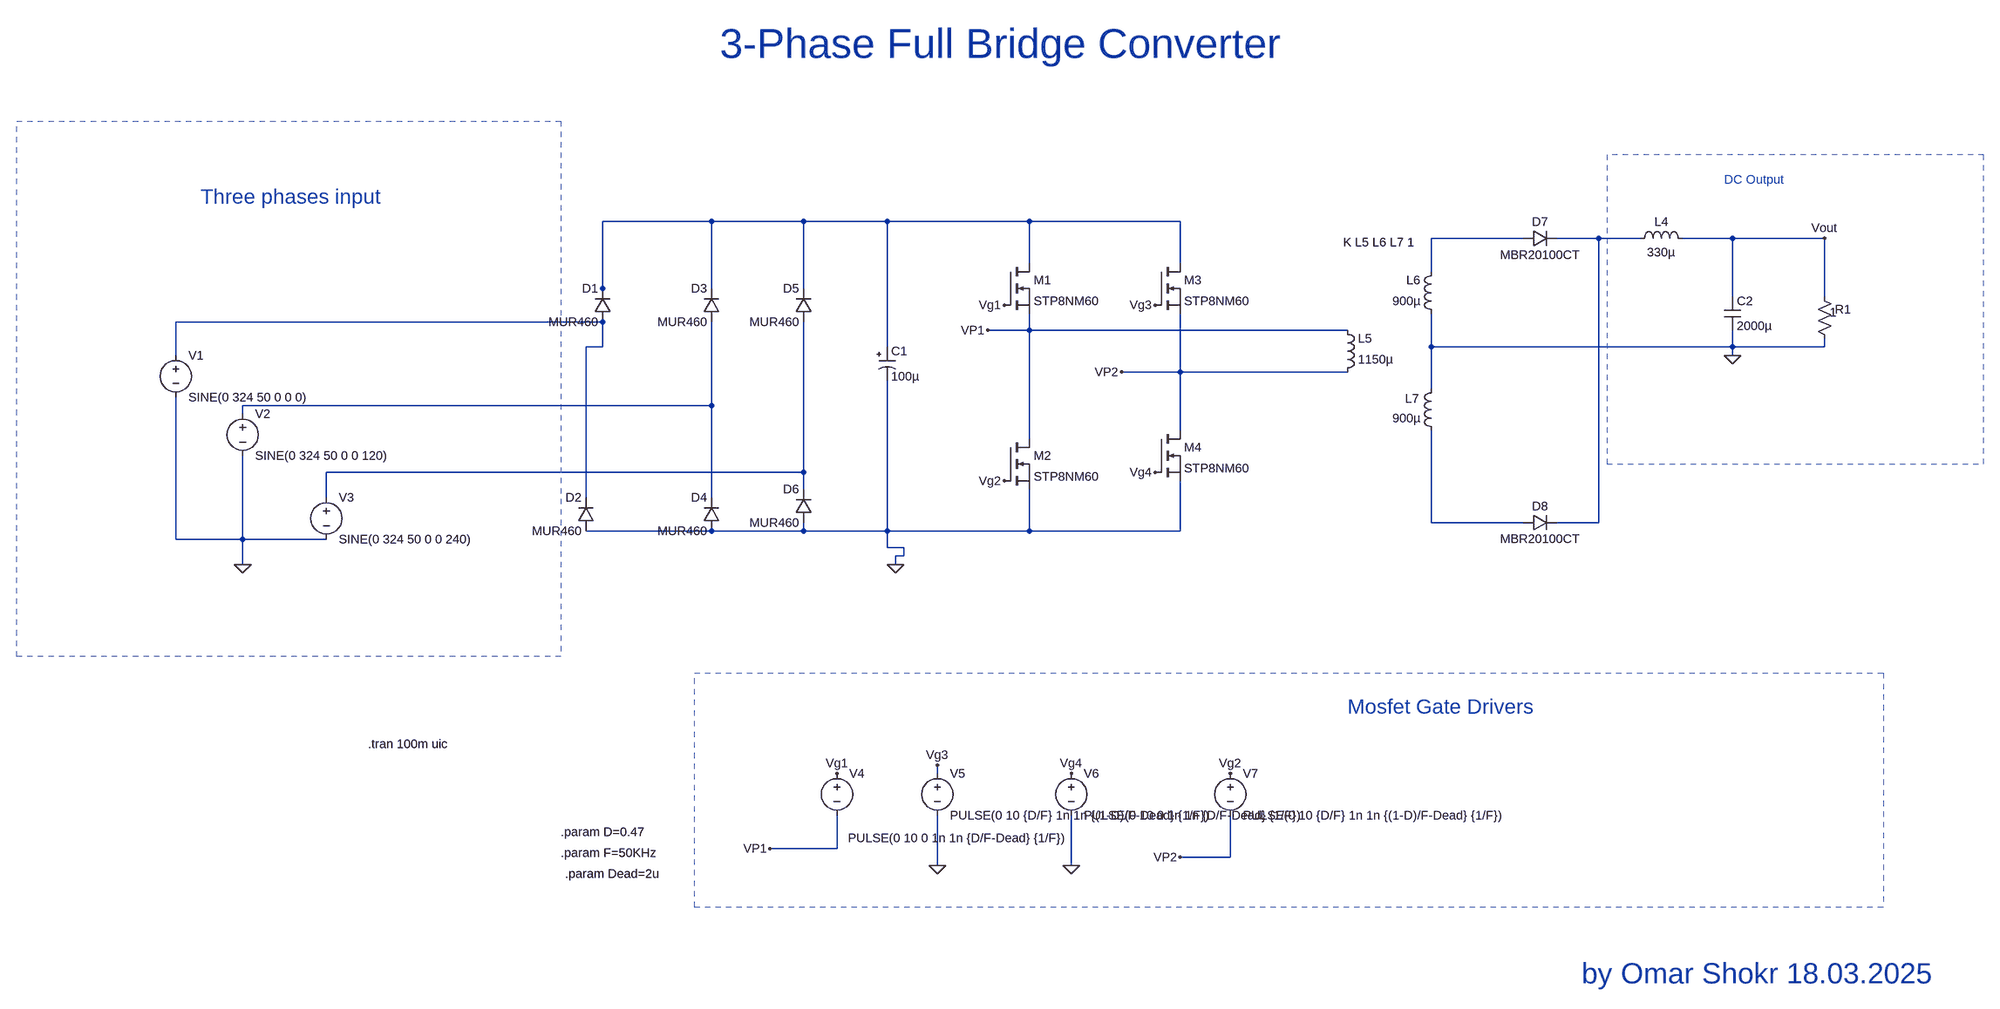
[diagram p0: schematic Three_Phase_Converter_Full_Bridge_Omar.asc]
Three_Phase_Converter_Full_Bridge_Omar.asc, the LTspice schematic file:
Version 4.1
SHEET 1 3540 1476
WIRE 1104 -192 896 -192
WIRE 1280 -192 1104 -192
WIRE 1440 -192 1280 -192
WIRE 1712 -192 1440 -192
WIRE 2000 -192 1712 -192
WIRE 2656 -160 2480 -160
WIRE 2800 -160 2720 -160
WIRE 2880 -160 2800 -160
WIRE 3056 -160 2960 -160
WIRE 3232 -160 3056 -160
WIRE 1712 -112 1712 -192
WIRE 2000 -112 2000 -192
WIRE 2480 -96 2480 -160
WIRE 896 -64 896 -192
WIRE 1104 -64 1104 -192
WIRE 1280 -64 1280 -192
WIRE 896 -48 896 -64
WIRE 3056 -48 3056 -160
WIRE 3232 -48 3232 -160
WIRE 896 0 80 0
WIRE 1712 16 1712 -16
WIRE 1712 16 1632 16
WIRE 2320 16 1712 16
WIRE 896 48 896 0
WIRE 896 48 864 48
WIRE 1440 48 1440 -192
WIRE 2480 48 2480 -16
WIRE 3056 48 3056 16
WIRE 3056 48 2480 48
WIRE 3232 48 3232 32
WIRE 3232 48 3056 48
WIRE 80 64 80 0
WIRE 3056 64 3056 48
WIRE 2000 96 2000 -16
WIRE 2000 96 1888 96
WIRE 2320 96 2000 96
WIRE 2480 128 2480 48
WIRE 1104 160 1104 0
WIRE 1104 160 208 160
WIRE 208 176 208 160
WIRE 2000 208 2000 96
WIRE 1712 224 1712 16
WIRE 1280 288 1280 0
WIRE 1280 288 368 288
WIRE 1280 320 1280 288
WIRE 368 336 368 288
WIRE 864 336 864 48
WIRE 1104 336 1104 160
WIRE 2480 384 2480 208
WIRE 2656 384 2480 384
WIRE 2800 384 2800 -160
WIRE 2800 384 2720 384
WIRE 1104 400 864 400
WIRE 1280 400 1280 384
WIRE 1280 400 1104 400
WIRE 1440 400 1440 112
WIRE 1440 400 1280 400
WIRE 1712 400 1712 320
WIRE 1712 400 1440 400
WIRE 2000 400 2000 304
WIRE 2000 400 1712 400
WIRE 80 416 80 144
WIRE 208 416 208 256
WIRE 208 416 80 416
WIRE 368 416 208 416
WIRE 1440 432 1440 400
WIRE 1472 432 1440 432
WIRE 1472 448 1472 432
WIRE 1472 448 1456 448
WIRE 208 464 208 416
WIRE 1456 464 1456 448
WIRE 1536 864 1536 848
WIRE 1344 1008 1344 944
WIRE 1344 1008 1216 1008
WIRE 2096 1024 2096 944
WIRE 2096 1024 2000 1024
WIRE 1536 1040 1536 944
WIRE 1792 1040 1792 944
FLAG 3056 64 0
FLAG 1216 1008 VP1
FLAG 1536 1040 0
FLAG 1792 1040 0
FLAG 2000 1024 VP2
FLAG 1344 864 Vg1
FLAG 2096 864 Vg2
FLAG 1664 -32 Vg1
FLAG 1632 16 VP1
FLAG 1536 848 Vg3
FLAG 1792 864 Vg4
FLAG 1952 -32 Vg3
FLAG 1952 288 Vg4
FLAG 1664 304 Vg2
FLAG 1888 96 VP2
FLAG 1456 464 0
FLAG 208 464 0
FLAG 3232 -160 Vout
SYMBOL voltage 80 48 R0
WINDOW 123 0 0 Left 0
WINDOW 39 0 0 Left 0
SYMATTR InstName V1
SYMATTR Value SINE(0 324 50 0 0 0)
SYMBOL voltage 208 160 R0
WINDOW 123 0 0 Left 0
WINDOW 39 0 0 Left 0
SYMATTR InstName V2
SYMATTR Value SINE(0 324 50 0 0 120)
SYMBOL voltage 368 320 R0
WINDOW 123 0 0 Left 0
WINDOW 39 0 0 Left 0
SYMATTR InstName V3
SYMATTR Value SINE(0 324 50 0 0 240)
SYMBOL diode 912 0 R180
WINDOW 0 24 64 Left 2
WINDOW 3 24 0 Left 2
SYMATTR InstName D1
SYMATTR Value MUR460
SYMBOL diode 880 400 R180
WINDOW 0 24 64 Left 2
WINDOW 3 24 0 Left 2
SYMATTR InstName D2
SYMATTR Value MUR460
SYMBOL diode 1120 0 R180
WINDOW 0 24 64 Left 2
WINDOW 3 24 0 Left 2
SYMATTR InstName D3
SYMATTR Value MUR460
SYMBOL diode 1120 400 R180
WINDOW 0 24 64 Left 2
WINDOW 3 24 0 Left 2
SYMATTR InstName D4
SYMATTR Value MUR460
SYMBOL diode 1296 0 R180
WINDOW 0 24 64 Left 2
WINDOW 3 24 0 Left 2
SYMATTR InstName D5
SYMATTR Value MUR460
SYMBOL diode 1296 384 R180
WINDOW 0 24 64 Left 2
WINDOW 3 24 0 Left 2
SYMATTR InstName D6
SYMATTR Value MUR460
SYMBOL polcap 1424 48 R0
SYMATTR InstName C1
SYMATTR Value 100µ
SYMBOL nmos 1664 -112 R0
SYMATTR InstName M1
SYMATTR Value STP8NM60
SYMBOL nmos 1664 224 R0
SYMATTR InstName M2
SYMATTR Value STP8NM60
SYMBOL nmos 1952 -112 R0
SYMATTR InstName M3
SYMATTR Value STP8NM60
SYMBOL nmos 1952 208 R0
SYMATTR InstName M4
SYMATTR Value STP8NM60
SYMBOL diode 2656 -144 R270
WINDOW 0 32 32 VTop 2
WINDOW 3 0 32 VBottom 2
SYMATTR InstName D7
SYMATTR Value MBR20100CT
SYMATTR Description Diode
SYMATTR Type diode
SYMBOL diode 2656 400 R270
WINDOW 0 32 32 VTop 2
WINDOW 3 0 32 VBottom 2
SYMATTR InstName D8
SYMATTR Value MBR20100CT
SYMATTR Description Diode
SYMATTR Type diode
SYMBOL ind 2864 -144 R270
WINDOW 0 32 56 VTop 2
WINDOW 3 5 56 VBottom 2
SYMATTR InstName L4
SYMATTR Value 330µ
SYMBOL cap 3040 -48 R0
SYMATTR InstName C2
SYMATTR Value 2000µ
SYMBOL res 3216 -64 R0
WINDOW 3 26 46 Left 2
SYMATTR InstName R1
SYMATTR Value 1
SYMBOL voltage 1344 848 R0
WINDOW 3 21 140 Left 2
WINDOW 123 0 0 Left 0
WINDOW 39 0 0 Left 0
SYMATTR InstName V4
SYMATTR Value PULSE(0 10 0 1n 1n {D/F-Dead} {1/F})
SYMBOL voltage 1536 848 R0
WINDOW 123 0 0 Left 0
WINDOW 39 0 0 Left 0
SYMATTR InstName V5
SYMATTR Value PULSE(0 10 {D/F} 1n 1n {(1-D)/F-Dead} {1/F})
SYMBOL voltage 1792 848 R0
WINDOW 123 0 0 Left 0
WINDOW 39 0 0 Left 0
SYMATTR InstName V6
SYMATTR Value PULSE(0 10 0 1n 1n {D/F-Dead} {1/F})
SYMBOL voltage 2096 848 R0
WINDOW 123 0 0 Left 0
WINDOW 39 0 0 Left 0
SYMATTR InstName V7
SYMATTR Value PULSE(0 10 {D/F} 1n 1n {(1-D)/F-Dead} {1/F})
SYMBOL ind 2304 112 M180
WINDOW 0 36 80 Left 2
WINDOW 3 36 40 Left 2
SYMATTR InstName L5
SYMATTR Value 1150µ
SYMATTR Type ind
SYMBOL ind 2496 0 R180
WINDOW 0 36 80 Left 2
WINDOW 3 36 40 Left 2
SYMATTR InstName L6
SYMATTR Value 900µ
SYMATTR Type ind
SYMBOL ind 2496 224 R180
WINDOW 0 39 77 Left 2
WINDOW 3 36 40 Left 2
SYMATTR InstName L7
SYMATTR Value 900µ
SYMATTR Type ind
TEXT 2312 -152 Left 2 !K L5 L6 L7 1
TEXT 816 976 Left 2 !.param D=0.47
TEXT 816 1016 Left 2 !.param F=50KHz
TEXT 824 1056 Left 2 !.param Dead=2u
TEXT 448 808 Left 2 !.tran 100m uic
TEXT 128 -240 Left 4 ;Three phases input
TEXT 2320 736 Left 4 ;Mosfet Gate Drivers
TEXT 3040 -272 Left 2 ;DC Output
TEXT 1120 -832 Left 6 ;3-Phase Full Bridge Converter
TEXT 2768 1440 Left 5 ;by Omar Shokr 18.03.2025
RECTANGLE Normal 816 640 -224 -384 2
RECTANGLE Normal 3344 1120 1072 672 2
RECTANGLE Normal 2816 272 3536 -320 2

The netlist it stands for:
* Three_Phase_Converter_Full_Bridge_Omar.asc
V1 N004 0 SINE(0 324 50 0 0 0)
V2 N005 0 SINE(0 324 50 0 0 120)
V3 N006 0 SINE(0 324 50 0 0 240)
D1 N004 N001 MUR460
D2 0 N004 MUR460
D3 N005 N001 MUR460
D4 0 N005 MUR460
D5 N006 N001 MUR460
D6 0 N006 MUR460
C1 N001 0 100µ
M1 N001 Vg1 VP1 VP1 STP8NM60
M2 VP1 Vg2 0 0 STP8NM60
M3 N001 Vg3 VP2 VP2 STP8NM60
M4 VP2 Vg4 0 0 STP8NM60
D7 N002 N003 MBR20100CT
D8 N007 N003 MBR20100CT
L4 N003 Vout 330µ
C2 Vout 0 2000µ
R1 Vout 0 1
V4 Vg1 VP1 PULSE(0 10 0 1n 1n {D/F-Dead} {1/F})
V5 Vg3 0 PULSE(0 10 {D/F} 1n 1n {(1-D)/F-Dead} {1/F})
V6 Vg4 0 PULSE(0 10 0 1n 1n {D/F-Dead} {1/F})
V7 Vg2 VP2 PULSE(0 10 {D/F} 1n 1n {(1-D)/F-Dead} {1/F})
L5 VP2 VP1 1150µ
L6 0 N002 900µ
L7 N007 0 900µ
.model D D
.lib standard.dio
.model NMOS NMOS
.model PMOS PMOS
.lib standard.mos
K L5 L6 L7 1
.param D=0.47
.param F=50KHz
.param Dead=2u
.tran 100m uic
* Three phases input
* Mosfet Gate Drivers
* DC Output
* 3-Phase Full Bridge Converter
* by Omar Shokr 18.03.2025
.backanno
.end